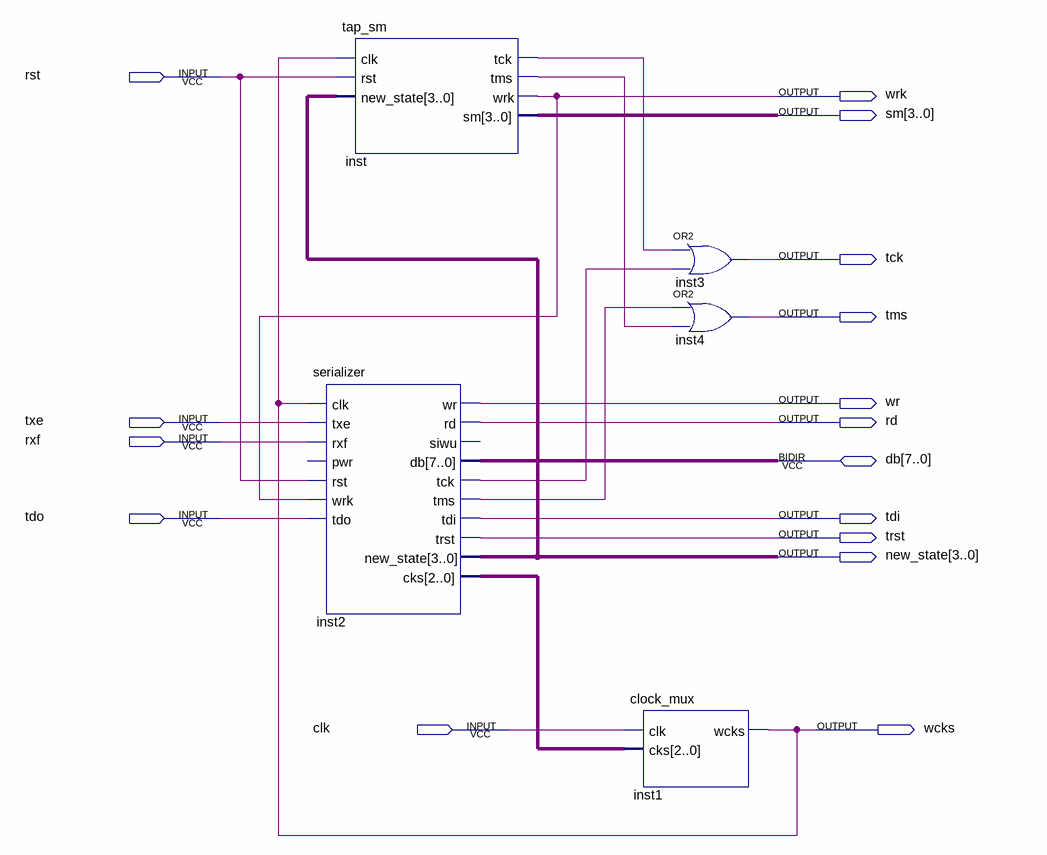
[diagram p0: schematic sheet]
// Quartus schematic Open_JTAG.bdf as structural Verilog: 5 symbols, 16 pins
module Open_JTAG (
  input  rst,
  input  txe,
  input  rxf,
  input  tdo,
  input  clk,
  inout  [7:0] db,
  output wrk,
  output [3:0] sm,
  output tck,
  output tms,
  output wr,
  output rd,
  output tdi,
  output trst,
  output [3:0] new_state,
  output wcks
);

  wire inst2_tck, inst2_tms, inst_tck, inst_tms;
  wire [2:0] inst2_cks;

  tap_sm inst (.clk(wcks), .rst(rst), .new_state(new_state), .tck(inst_tck), .tms(inst_tms), .wrk(wrk), .sm(sm));
  serializer inst2 (
    .clk(wcks), .txe(txe), .rxf(rxf), .rst(rst), .wrk(wrk), .tdo(tdo), .wr(wr), .rd(rd), .tck(inst2_tck),
    .tms(inst2_tms), .tdi(tdi), .trst(trst), .new_state(new_state), .cks(inst2_cks), .db(db));  // open: pwr, siwu
  clock_mux inst1 (.clk(clk), .cks(inst2_cks), .wcks(wcks));
  or inst3 (tck, inst_tck, inst2_tck);
  or inst4 (tms, inst2_tms, inst_tms);
endmodule
